# EAGLE design Main board (EAGLE 9.2.2)
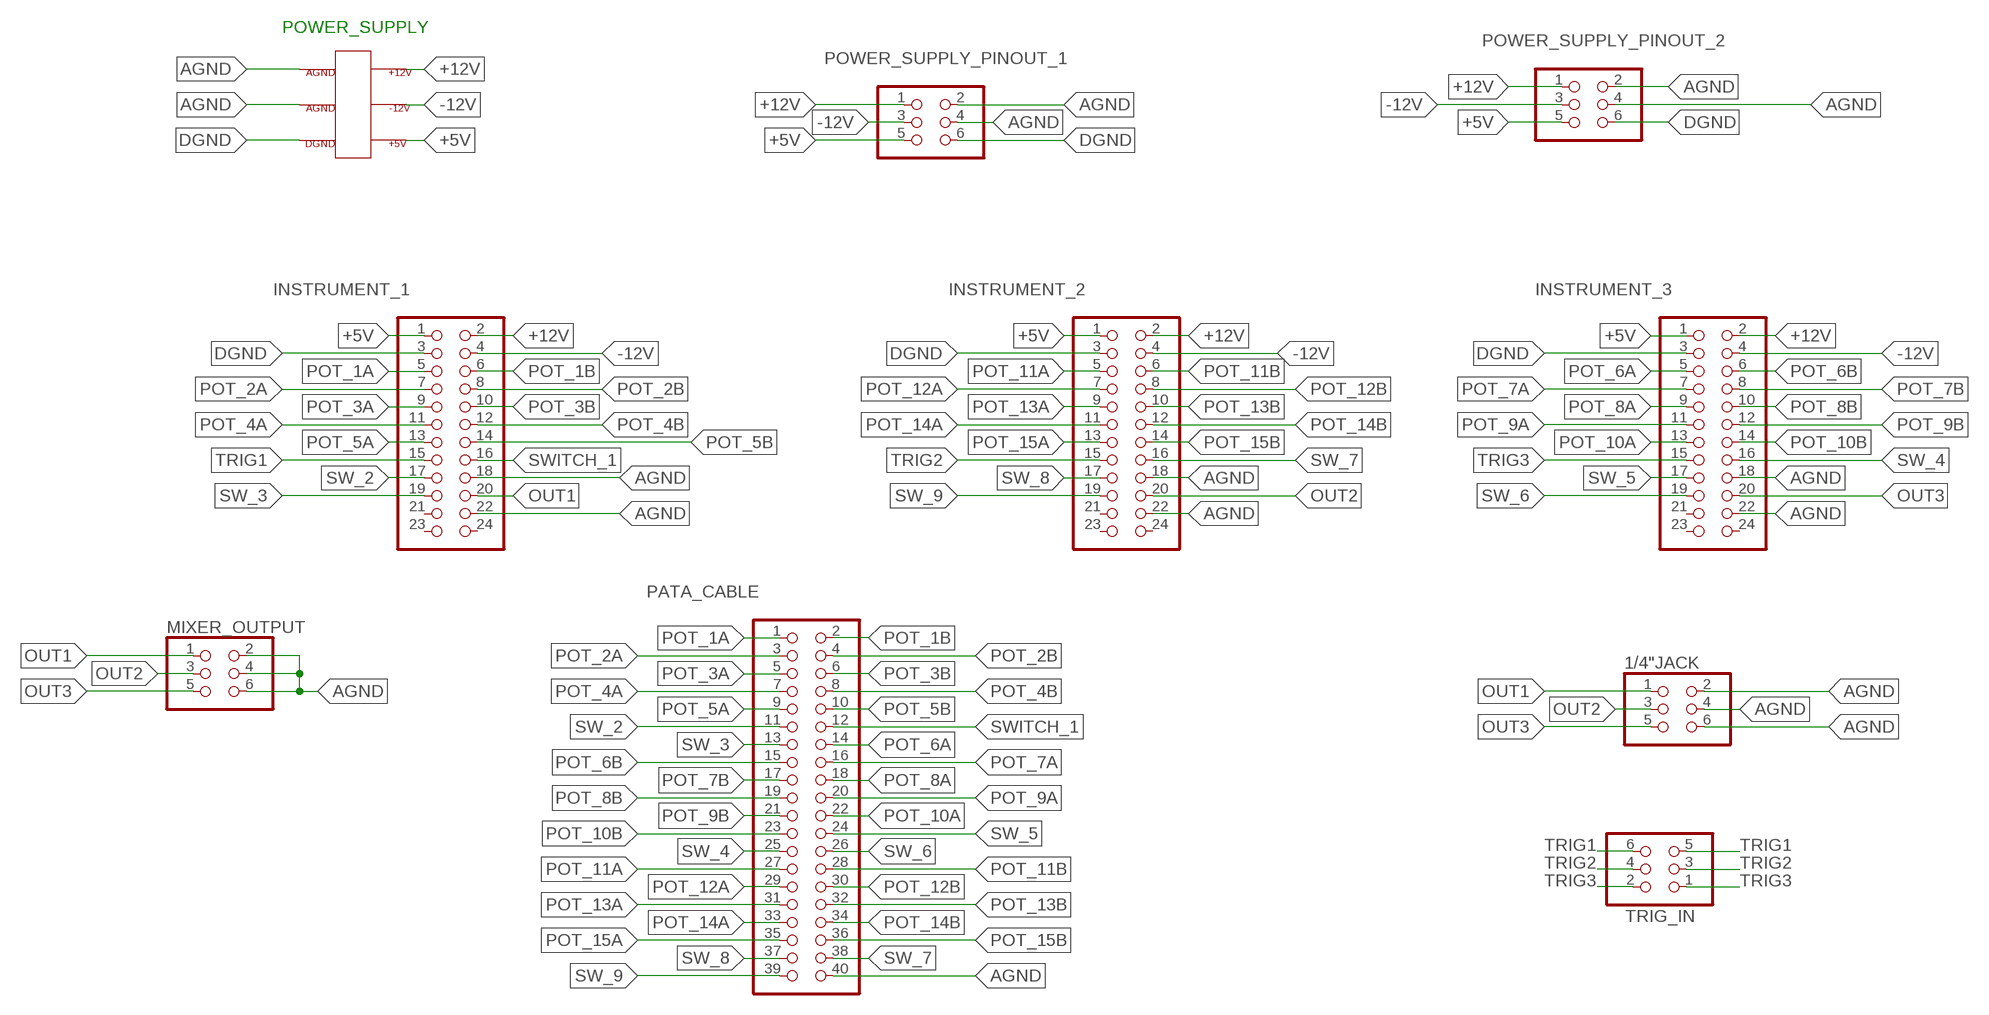
[diagram p0: schematic, sheet 1]

## Parts
1/4"JACK  PINHD-2X3  [2X03]
INSTRUMENT_1  PINHD-2X12  [2X12]
INSTRUMENT_2  PINHD-2X12  [2X12]
INSTRUMENT_3  PINHD-2X12  [2X12]
MIXER_OUTPUT  PINHD-2X3  [2X03]
PATA_CABLE  PINHD-2X20  [2X20]
POWER_SUPPLY  TER6PIN_VERT  [CAPSTONE_1-770875-0]
POWER_SUPPLY_PINOUT_1  PINHD-2X3  [2X03]
POWER_SUPPLY_PINOUT_2  PINHD-2X3  [2X03]
TRIG_IN  PINHD-2X3  [2X03]

## Nets
+5V: INSTRUMENT_1.1 INSTRUMENT_2.1 INSTRUMENT_3.1 POWER_SUPPLY.+5V POWER_SUPPLY.NULL(+5V) POWER_SUPPLY_PINOUT_1.5 POWER_SUPPLY_PINOUT_2.5
+12V: INSTRUMENT_1.2 INSTRUMENT_2.2 INSTRUMENT_3.2 POWER_SUPPLY.+12V POWER_SUPPLY_PINOUT_1.1 POWER_SUPPLY_PINOUT_2.1
-12V: INSTRUMENT_1.4 INSTRUMENT_2.4 INSTRUMENT_3.4 POWER_SUPPLY.-12V POWER_SUPPLY_PINOUT_1.3 POWER_SUPPLY_PINOUT_2.3
AGND: 1/4"JACK.2 1/4"JACK.4 1/4"JACK.6 INSTRUMENT_1.18 INSTRUMENT_1.22 INSTRUMENT_2.18 INSTRUMENT_2.22 INSTRUMENT_3.18 INSTRUMENT_3.22 MIXER_OUTPUT.2 MIXER_OUTPUT.4 MIXER_OUTPUT.6 PATA_CABLE.40 POWER_SUPPLY.AGND0 POWER_SUPPLY.AGND1 POWER_SUPPLY_PINOUT_1.2 POWER_SUPPLY_PINOUT_1.4 POWER_SUPPLY_PINOUT_2.2 POWER_SUPPLY_PINOUT_2.4
DGND: INSTRUMENT_1.3 INSTRUMENT_2.3 INSTRUMENT_3.3 POWER_SUPPLY.DGND POWER_SUPPLY_PINOUT_1.6 POWER_SUPPLY_PINOUT_2.6
OUT1: 1/4"JACK.1 INSTRUMENT_1.20 MIXER_OUTPUT.1
OUT2: 1/4"JACK.3 INSTRUMENT_2.20 MIXER_OUTPUT.3
OUT3: 1/4"JACK.5 INSTRUMENT_3.20 MIXER_OUTPUT.5
POT_1A: INSTRUMENT_1.5 PATA_CABLE.1
POT_1B: INSTRUMENT_1.6 PATA_CABLE.2
POT_2A: INSTRUMENT_1.7 PATA_CABLE.3
POT_2B: INSTRUMENT_1.8 PATA_CABLE.4
POT_3A: INSTRUMENT_1.9 PATA_CABLE.5
POT_3B: INSTRUMENT_1.10 PATA_CABLE.6
POT_4A: INSTRUMENT_1.11 PATA_CABLE.7
POT_4B: INSTRUMENT_1.12 PATA_CABLE.8
POT_5A: INSTRUMENT_1.13 PATA_CABLE.9
POT_5B: INSTRUMENT_1.14 PATA_CABLE.10
POT_6A: INSTRUMENT_3.5 PATA_CABLE.14
POT_6B: INSTRUMENT_3.6 PATA_CABLE.15
POT_7A: INSTRUMENT_3.7 PATA_CABLE.16
POT_7B: INSTRUMENT_3.8 PATA_CABLE.17
POT_8A: INSTRUMENT_3.9 PATA_CABLE.18
POT_8B: INSTRUMENT_3.10 PATA_CABLE.19
POT_9A: INSTRUMENT_3.11 PATA_CABLE.20
POT_9B: INSTRUMENT_3.12 PATA_CABLE.21
POT_10A: INSTRUMENT_3.13 PATA_CABLE.22
POT_10B: INSTRUMENT_3.14 PATA_CABLE.23
POT_11A: INSTRUMENT_2.5 PATA_CABLE.27
POT_11B: INSTRUMENT_2.6 PATA_CABLE.28
POT_12A: INSTRUMENT_2.7 PATA_CABLE.29
POT_12B: INSTRUMENT_2.8 PATA_CABLE.30
POT_13A: INSTRUMENT_2.9 PATA_CABLE.31
POT_13B: INSTRUMENT_2.10 PATA_CABLE.32
POT_14A: INSTRUMENT_2.11 PATA_CABLE.33
POT_14B: INSTRUMENT_2.12 PATA_CABLE.34
POT_15A: INSTRUMENT_2.13 PATA_CABLE.35
POT_15B: INSTRUMENT_2.14 PATA_CABLE.36
SW_2: INSTRUMENT_1.17 PATA_CABLE.11
SW_3: INSTRUMENT_1.19 PATA_CABLE.13
SW_4: INSTRUMENT_3.16 PATA_CABLE.25
SW_5: INSTRUMENT_3.17 PATA_CABLE.24
SW_6: INSTRUMENT_3.19 PATA_CABLE.26
SW_7: INSTRUMENT_2.16 PATA_CABLE.38
SW_8: INSTRUMENT_2.17 PATA_CABLE.37
SW_9: INSTRUMENT_2.19 PATA_CABLE.39
SWITCH_1: INSTRUMENT_1.16 PATA_CABLE.12
TRIG1: INSTRUMENT_1.15 TRIG_IN.5 TRIG_IN.6
TRIG2: INSTRUMENT_2.15 TRIG_IN.3 TRIG_IN.4
TRIG3: INSTRUMENT_3.15 TRIG_IN.1 TRIG_IN.2
Unconnected: INSTRUMENT_1.21 INSTRUMENT_1.23 INSTRUMENT_1.24 INSTRUMENT_2.21 INSTRUMENT_2.23 INSTRUMENT_2.24 INSTRUMENT_3.21 INSTRUMENT_3.23 INSTRUMENT_3.24

## Notes on the sheet
- POWER_SUPPLY

## Library data of the parts
1/4"JACK MIXER_OUTPUT POWER_SUPPLY_PINOUT_1 POWER_SUPPLY_PINOUT_2 TRIG_IN = pinhead:PINHD-2X3: PIN HEADER
INSTRUMENT_1-INSTRUMENT_3 = pinhead:PINHD-2X12: PIN HEADER
PATA_CABLE = pinhead:PINHD-2X20: PIN HEADER
POWER_SUPPLY = TE6Pin:TER6PIN_VERT

## Board
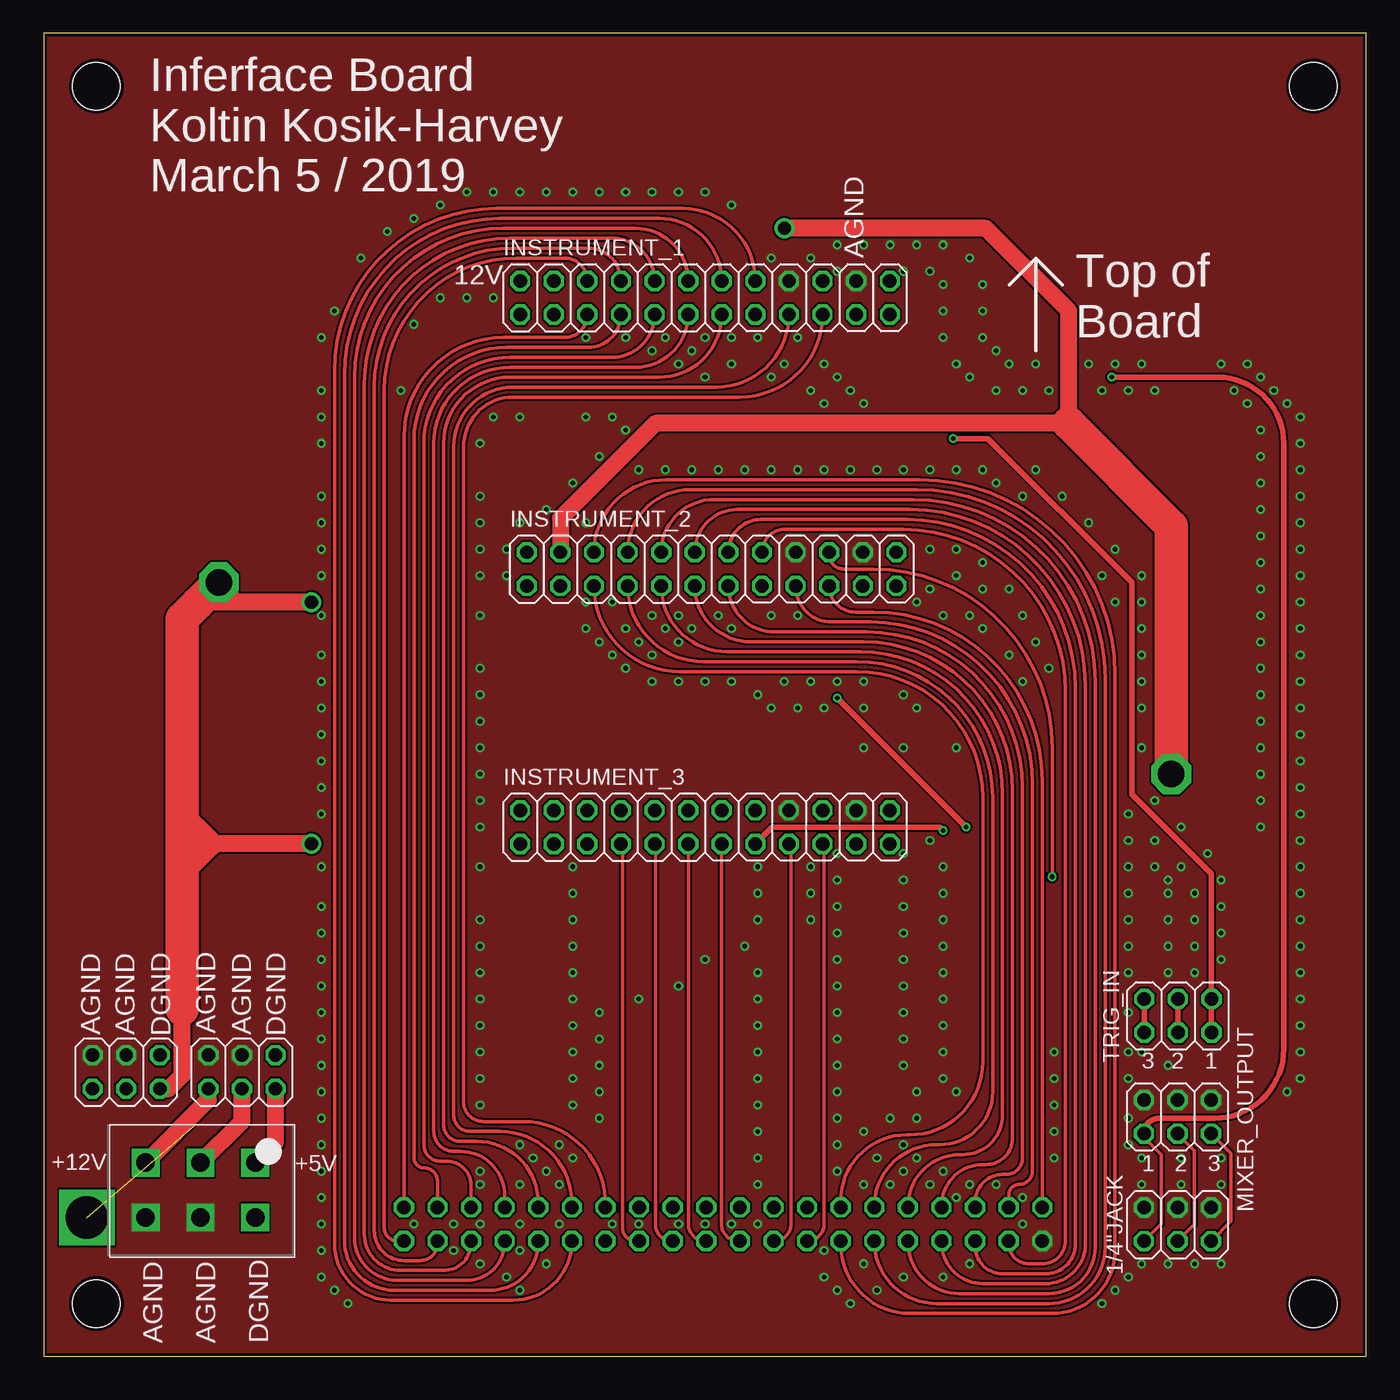
[diagram p1: board, top side]
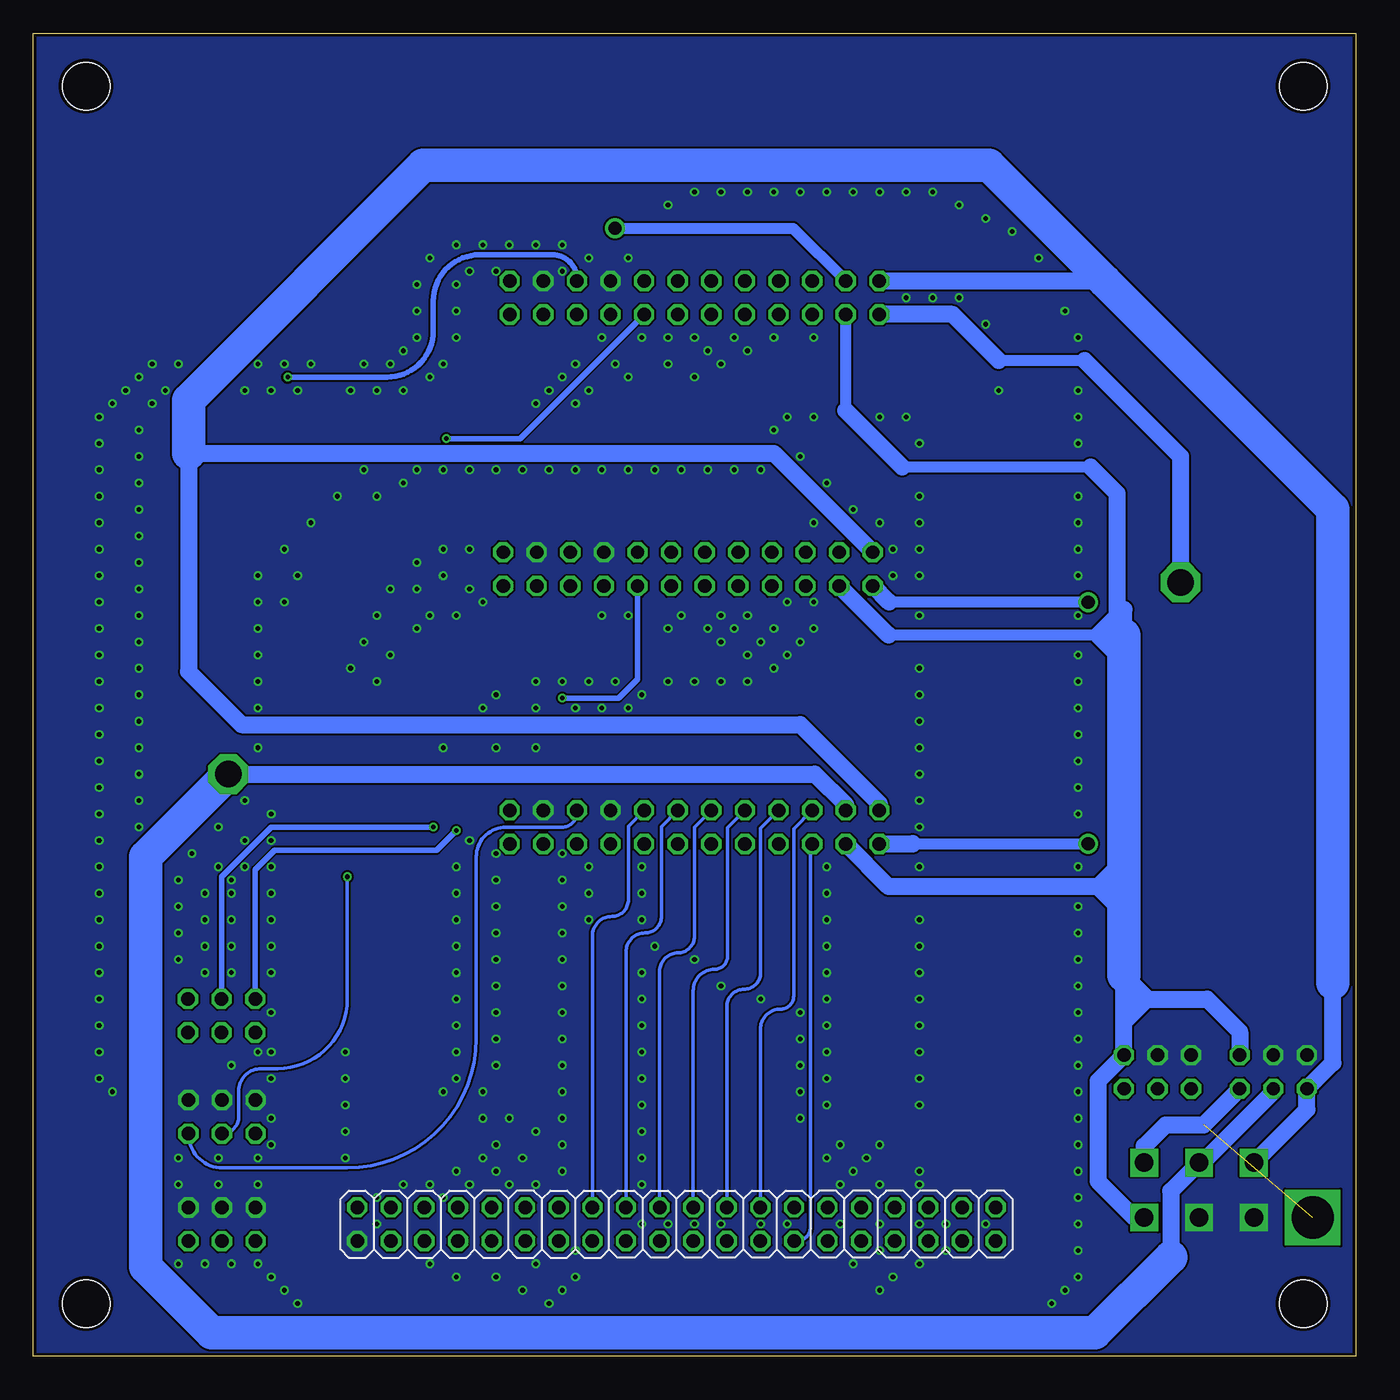
[diagram p2: board, bottom side, seen from below]

Size 100 x 100 mm. Coordinates in mm from the lower left corner, seen from the top.
Outline: 0,0 100,0 100,100 0,100 0,0
Copper layers (1*16): Top 0.035mm / dielectric 1.5mm / Bottom 0.035mm
Design rules "SeeedStudio_2layer_DRU_no_angle_20140221": minimum track width 6mil, minimum drill 12mil, track to track 6mil, track to pad 6mil, pad to pad 6mil, via to via 6mil, smd to smd 0mil, copper to edge 10mil, drill to drill 10mil, minimum pad ring 10mil, minimum via ring 6mil, stop-mask expansion 2mil, vias tented up to drill 100mil, thermal gap 10mil
Holes 3.6 mm at 4,4 4,96 96,96 96,4

### Footprints (pad centres in the part's own frame; a part is rotated, then mirrored left to right if it is on the bottom)
2X03 = drill 1.016 octagon: 1 -2.54,-1.27; 2 -2.54,1.27; 3 0,-1.27; 4 0,1.27; 5 2.54,-1.27; 6 2.54,1.27
2X12 = drill 1.016 octagon: 1 -13.97,-1.27; 2 -13.97,1.27; 3 -11.43,-1.27; 4 -11.43,1.27; 5 -8.89,-1.27; 6 -8.89,1.27; 7 -6.35,-1.27; 8 -6.35,1.27; 9 -3.81,-1.27; 10 -3.81,1.27; 11 -1.27,-1.27; 12 -1.27,1.27; 13 1.27,-1.27; 14 1.27,1.27; 15 3.81,-1.27; 16 3.81,1.27; 17 6.35,-1.27; 18 6.35,1.27; 19 8.89,-1.27; 20 8.89,1.27; 21 11.43,-1.27; 22 11.43,1.27; 23 13.97,-1.27; 24 13.97,1.27
2X20 = drill 1.016 octagon: 1 -24.13,-1.27; 2 -24.13,1.27; 3 -21.59,-1.27; 4 -21.59,1.27; 5 -19.05,-1.27; 6 -19.05,1.27; 7 -16.51,-1.27; 8 -16.51,1.27; 9 -13.97,-1.27; 10 -13.97,1.27; 11 -11.43,-1.27; 12 -11.43,1.27; 13 -8.89,-1.27; 14 -8.89,1.27; 15 -6.35,-1.27; 16 -6.35,1.27; 17 -3.81,-1.27; 18 -3.81,1.27; 19 -1.27,-1.27; 20 -1.27,1.27; 21 1.27,-1.27; 22 1.27,1.27; 23 3.81,-1.27; 24 3.81,1.27; 25 6.35,-1.27; 26 6.35,1.27; 27 8.89,-1.27; 28 8.89,1.27; 29 11.43,-1.27; 30 11.43,1.27; 31 13.97,-1.27; 32 13.97,1.27; 33 16.51,-1.27; 34 16.51,1.27; 35 19.05,-1.27; 36 19.05,1.27; 37 21.59,-1.27; 38 21.59,1.27; 39 24.13,-1.27; 40 24.13,1.27
CAPSTONE_1-770875-0 = drill 1.4 square: +5V 0,-4.14; +12V 8.28,-4.14; -12V 4.14,-4.14; AGND0 4.14,0; AGND1 8.28,0; DGND 0,0 | drill 3.18 square: NULL 12.73,0

### Placement (x,y rotation side)
1/4"JACK  85.72,9.98 0 top
INSTRUMENT_1  50,80 0 top
INSTRUMENT_2  50.5,59.5 0 top
INSTRUMENT_3  50,40 0 top
MIXER_OUTPUT  85.72,18.11 0 top
PATA_CABLE  51.37,10 180 bottom
POWER_SUPPLY  16,10.5 180 top
POWER_SUPPLY_PINOUT_1  6.25,21.5 0 top
POWER_SUPPLY_PINOUT_2  15,21.5 0 top
TRIG_IN  85.75,25.75 0 top

### Tracks (layer width: path | path; a pad name or v marks a point on that pad's centre or on a via)
+5V  (via drill 1, 2)  (1 unrouted)
  Top 1.016: 14.5,57 14.5,57.25 v13.25,58.5
  Top 1.27: POWER_SUPPLY.+5V 17.54,16.18 POWER_SUPPLY_PINOUT_2.5 | POWER_SUPPLY_PINOUT_1.5 9.48,20.23 10.5,21.25 10.5,26.25 | 11.62,56.88 11.75,57 14.5,57 v20.25,57 | v20.25,38.75 12.75,38.75 | 12.75,38.75 10.5,38.75 | 12.75,38.75 12.75,39 10.5,41.25 | 12.75,38.75 12.75,38.5 10.5,36.25
  Top 2.54: 10.5,26.25 10.5,36.25 10.5,38.75 10.5,41.25 10.5,55.75 11.62,56.88 v13.25,58.5
  Bottom 0.813: 20.5,75.25 27,75.25 | v20.25,57 35.3,57 | 33.5,38.75 v20.25,38.75
  Bottom 1.27: POWER_SUPPLY.+5V 16,15.89 14.39,17.5 11.52,17.5 POWER_SUPPLY_PINOUT_1.5 | 27,75.25 30.5,78.75 36.01,78.75 INSTRUMENT_1.1 | v13.25,58.5 13.25,68 20.5,75.25 | 35.3,57 INSTRUMENT_2.1 | INSTRUMENT_3.1 33.52,38.73 33.5,38.75
+12V
  Top 1.27: POWER_SUPPLY.+12V 12.46,19.38 POWER_SUPPLY_PINOUT_2.1
  Bottom 1.27: POWER_SUPPLY.+12V 3.71,18.65 POWER_SUPPLY_PINOUT_1.1 1.75,22.19 1.75,28.25 | 19,81.25 36.01,81.25 INSTRUMENT_1.2 | INSTRUMENT_2.2 44.01,68.25 88.25,68.25 88.25,51.75 84.25,47.75 42.01,47.75 36.03,41.77 INSTRUMENT_3.2
  Bottom 2.54: 1.75,28.25 1.75,64 19,81.25 27.75,90 70.5,90 88.25,72.25 88.25,68.25
-12V  (via drill 1, 2)
  Top 1.27: POWER_SUPPLY.-12V 15,17.78 POWER_SUPPLY_PINOUT_2.3 | INSTRUMENT_2.4 39.07,63.32 46.25,70.5 77.5,70.5 77.5,79 71.25,85.25 v56,85.25
  Top 2.54: v85.25,44 85.25,62.75 77.5,70.5
  Bottom 0.813: v56,85.25 42.55,85.25 INSTRUMENT_1.4
  Bottom 1.27: POWER_SUPPLY_PINOUT_1.3 6.25,20 11.61,14.64 POWER_SUPPLY.-12V 14,12.5 14,7.5 | INSTRUMENT_3.4 38.57,41.67 40.9,44 v85.25,44
  Bottom 2.54: 14,7.5 19.73,1.77 86.5,1.77 91.5,6.77 91.5,37.75 v85.25,44
AGND  (via drill 0.35)
  other vias: 21,6 21,8 21,10 21,12 21,14 21,16 21,18 21,20 21,22 21,24 21,26 21,28 21,30 21,32 21,34 21,37 21,41 21,43 21,45 21,47 21,49 21,51 21,53 21,56 21,59 21,61 21,63 21,65 21,69 21,71 21,73 21,77 22,79 24,83 26,85 28,86 30,87 32,88 34,88 36,88 38,88 40,88 42,88 44,88 46,88 48,88 50,88 52,87 55,83 58,83 60,84 62,84 64,84 66,84 68,84 70,83 71,81 71,79 71,77 72,76 73,75 75,75 79,75 81,75 83,75 89,75 91,75 92,74 93,73 94,72 95,71 95,69 95,67 95,65 95,63 95,61 95,59 95,57 95,55 95,53 95,51 95,49 95,47 95,45 95,43 95,41 95,39 95,37 95,35 95,33 95,31 95,29 95,27 95,25 95,23 95,21 94,20 89,15 89,13 86,13 86,15 83,15 83,13 83,7 85,7 87,7 89,7 81,5 82,6 80,4 61,4 60,5 59,6 59,8 62,7 63,5 65,6 68,6 70,7 74,10 76.4,15 76.4,17 76.4,19 76.4,21 76.4,23 85,22 83,23 92,40 92,42 92,44 92,46 92,48 92,50 92,52 92,54 92,56 92,58 92,60 92,62 92,64 92,66 92,68 92,70 91,72 90,73 84,73 82,73 80,73 76,73 74,73 72,73 70,74 69,75 68,77 68,79 68,81 67,82 65,82 60,82 50,74 52,75 54,77 52,77 49,76 48,75 50,77 47,77 46,76 44,77 41,77 27,73 30,80 32,80 34,80 28,78 33,19 33,21 33,23 33,25 33,27 33,29 33,31 33,33 33,37 33,40 33,42 33,44 33,46 33,48 33,50 33,52 33,56 33,59 33,61 33,63 33,65 33,69 34,71 36,71 41,71 43,71 35,59 35,61 36,63 38,64 40,66 42,68 44,70 41,63 45,67 47,67 49,67 51,67 53,67 55,67 57,67 59,67 61,67 63,67 65,67 67,67 69,67 72,66 71,67 74,65 80,59 81,57 76,52 75,54 74,56 73,58 71,60 69,61 67,61 69,59 71,58 74,51 73,53 71,55 70,56 68,56 67,58 66,57 69,46 65,46 66,49 65,50 62,51 60,51 58,51 56,51 54,50 57,49 55,49 59,49 62,49 62,46 55,56 57,56 52,55 51,56 49,55 48,56 46,56 47,55 48,54 43,57 44,55 45,54 46,53 41,57 41,55 42,54 43,53 44,52 46,51 48,51 50,51 52,51 40,31 40,33 40,35 40,37 40,29 40,27 40,25 40,23 40,21 40,19 42,18 42,20 42,22 42,24 42,26 45,27 48,28 50,30 53,31 54,29 54,27 54,25 54,23 54,21 54,19 54,17 54,15 54,13 54,33 54,35 54,37 58,37 58,35 60,14 60,16 60,18 60,20 60,22 60,24 60,26 60,28 60,30 60,32 60,34 60,36 60,38 58,33 62,17 64,18 66,18 69,20 68,21 68,23 68,25 68,27 68,29 68,31 68,33 68,35 68,37 67,39 65,38 65,36 65,34 65,32 65,30 65,28 65,26 65,24 65,22 66,20 62,13 63,15 65,16 64,13 65,14 66,15 67,13 68,14 69,12 70,13 72,13 74,12 82,37 82,35 82,33 82,31 82,29 82,26 82,23 82,21 82,16 82,18 75,67 77,65 79,63 81,61 83,59 83,57 83,55 83,53 83,51 83,49 83,46 82,41 84,39 86,37 87,35 84,42 86,40 88,38 89,36 89,34 89,32 89,30 87,29 87,31 87,33 85,29 85,31 85,33 85,35 85,36 84,37 82,39 62,72 60,74 59,75 57,77 56,75 55,74 58,73 59,72 61,73 39,16 40,15 39,13 38,14 37,15 36,16 36,13 33,13 33,14 33,10 31,10 28,10 36,10 39,10 43,10 45,10 48,10 50,10 52,10 54,10 38,7 36,5 35,6 36,8 33,7 31,8 22,5 23,4
  pour Top (no thermals): -1,0 -1,100 100,100 100,0
  pour Bottom (no thermals): -1.5,0 -1.5,100 100,100 100,0
DGND
  Bottom 0.813: 38.57,71.48 INSTRUMENT_1.3 | 34.32,67.23 20.07,67.23 | 19.5,54.5 35.34,54.5
  Bottom 1.27: 17.54,25.25 POWER_SUPPLY_PINOUT_2.6 19.5,20.81 19.5,13.25 16.75,10.5 POWER_SUPPLY.DGND | 17.54,25.25 17.54,27 | 17.54,27 17.54,28.79 15.75,27 | 17.54,56.46 17.54,54.5 19.5,54.5 | 38.57,71.48 34.32,67.23 | 20.07,67.23 18.04,65.2 18.04,55.96 19.5,54.5 | 35.34,54.5 INSTRUMENT_2.3 | 19.5,54.5 17.54,52.54 | 17.54,27 15.79,27 | 15.75,27 11.25,27 8.79,24.54 POWER_SUPPLY_PINOUT_1.6 | 17.54,25.25 15.79,27 | 15.79,27 15.75,27 | 17.54,35.5 19.5,35.5 | 19.5,35.5 35.34,35.5 INSTRUMENT_3.3 | 19.5,35.5 17.54,37.46 | 19.5,35.5 17.54,33.54
  Bottom 2.54: 17.54,54.5 17.54,52.54 17.54,37.46 17.54,35.5 17.54,33.54 17.54,28.79
OUT1  (via drill 0.35)
  Top 0.254: MIXER_OUTPUT.1 83.18,16.57 84.5,15.25 84.5,10.03 1/4"JACK.1
  Top 0.406: v80.75,74 88.75,74 arc-90 93.75,69 93.75,23.25 arc-90 88.5,18 84.34,18 arc90 MIXER_OUTPUT.1
  Bottom 0.406: INSTRUMENT_1.20 58.89,81.39 arc-90 60.75,83.25 66.25,83.25 arc-90 69.75,79.75 69.75,77.5 arc90 73.25,74 v80.75,74
OUT2  (via drill 0.35)
  Top 0.254: v76.25,36.25 76.25,46 arc90 62.75,59.5 60.5,59.5 arc-90 59.39,60.61 INSTRUMENT_2.20 | MIXER_OUTPUT.3 87,15.56 87,9.99 1/4"JACK.3
  Bottom 0.254: v76.25,36.25 76.25,27 arc90 81.5,21.75 82.75,21.75 arc-90 84.45,20.05 84.45,18.11 arc90 MIXER_OUTPUT.3
OUT3
  Top 0.254: MIXER_OUTPUT.5 89.75,15.35 89.75,10.2 1/4"JACK.5
  Bottom 0.254: MIXER_OUTPUT.5 arc-90 85.67,14.25 76.25,14.25 arc-90 66.5,24 66.5,37.75 arc90 64.25,40 60,40 arc-90 58.89,41.11 INSTRUMENT_3.20
POT_1A
  Top 0.254: PATA_CABLE.1 arc90 PATA_CABLE.1 27.25,69.5 arc-90 34.75,77 39.38,77 arc90 INSTRUMENT_1.5
POT_1B
  Top 0.254: PATA_CABLE.2 26.77,8.73 arc-90 25.75,9.75 25.75,73 arc-90 35.75,83 39.38,83 arc-90 INSTRUMENT_1.6
POT_2A
  Top 0.254: PATA_CABLE.3 29.78,13.22 arc90 28.75,14.25 arc-90 28,15 28,69.25 arc-90 35,76.25 41.17,76.25 arc90 INSTRUMENT_1.7
POT_2B
  Top 0.254: PATA_CABLE.4 29.78,8.53 arc-90 28.5,7.25 27.25,7.25 arc-90 25,9.5 25,73.25 arc-90 35.5,83.75 41.17,83.75 arc-90 INSTRUMENT_1.8
POT_3A
  Top 0.254: PATA_CABLE.5 32.32,12.93 arc90 30.5,14.75 30,14.75 arc-90 28.75,16 28.75,69 arc-90 35.25,75.5 42.96,75.5 arc90 INSTRUMENT_1.9
POT_3B
  Top 0.254: PATA_CABLE.6 32.32,8.57 arc-90 30.25,6.5 27,6.5 arc-90 24.25,9.25 24.25,73.5 arc-90 35.25,84.5 42.96,84.5 arc-90 INSTRUMENT_1.10
POT_4A
  Top 0.254: PATA_CABLE.7 34.86,12.14 arc90 31.5,15.5 31,15.5 arc-90 29.5,17 29.5,69 arc-90 35.25,74.75 44.75,74.75 arc90 INSTRUMENT_1.11
POT_4B
  Top 0.254: PATA_CABLE.8 34.86,8.61 arc-90 32,5.75 26.75,5.75 arc-90 23.5,9 23.5,74 arc-90 34.75,85.25 44.75,85.25 arc-90 INSTRUMENT_1.12
POT_5A
  Top 0.254: PATA_CABLE.9 37.4,11.6 arc90 32.75,16.25 31.5,16.25 arc-90 30.25,17.5 30.25,69 arc-90 35.25,74 46.54,74 arc90 INSTRUMENT_1.13
POT_5B
  Top 0.254: PATA_CABLE.10 37.4,8.65 arc-90 33.75,5 26.5,5 arc-90 22.75,8.75 22.75,74.25 arc-90 34.5,86 46.54,86 arc-90 INSTRUMENT_1.14
POT_6A
  Bottom 0.254: PATA_CABLE.14 42.27,8.73 arc-90 41.25,9.75 41.25,38.59 arc90 INSTRUMENT_3.5
POT_6B
  Bottom 0.254: PATA_CABLE.15 45.02,24.73 arc90 43.5,26.25 arc-90 42.5,27.25 42.5,39.88 INSTRUMENT_3.6
POT_7A
  Top 0.254: PATA_CABLE.16 44.77,8.73 arc-90 43.75,9.75 43.75,38.63 arc90 INSTRUMENT_3.7
POT_7B
  Bottom 0.254: INSTRUMENT_3.8 45,39.92 45,29 arc90 46.25,27.75 arc-90 47.56,26.44 PATA_CABLE.17
POT_8A
  Top 0.254: PATA_CABLE.18 47.52,8.73 arc-90 46.25,10 46.25,38.67 arc90 INSTRUMENT_3.9
POT_8B
  Bottom 0.254: PATA_CABLE.19 50.1,27.65 arc90 48.5,29.25 arc-90 47.5,30.25 47.5,39.96 INSTRUMENT_3.10
POT_9A
  Top 0.254: PATA_CABLE.20 50.02,8.73 arc-90 48.75,10 48.75,38.71 arc90 INSTRUMENT_3.11
POT_9B
  Bottom 0.254: INSTRUMENT_3.12 50,40 50,31.75 arc90 51.25,30.5 arc-90 52.64,29.11 PATA_CABLE.21
POT_10A
  Top 0.254: INSTRUMENT_3.13 arc90 51.25,38.71 51.25,10 arc90 52.52,8.73 PATA_CABLE.22
POT_10B
  Bottom 0.254: PATA_CABLE.23 55.18,30.57 arc90 53.75,32 arc-90 52.5,33.25 52.5,40.04 INSTRUMENT_3.14
POT_11A
  Top 0.254: PATA_CABLE.27 60.26,11.76 arc-90 65.25,16.75 65.5,16.75 arc90 71,22.25 71,42.25 arc90 61.5,51.75 48.09,51.75 arc-90 INSTRUMENT_2.5
POT_11B
  Top 0.254: PATA_CABLE.28 60.26,8.49 arc90 65.5,3.25 76.25,3.25 arc90 81,8 81,51.5 arc90 66.25,66.25 47.09,66.25 arc90 INSTRUMENT_2.6
POT_12A
  Top 0.254: PATA_CABLE.29 62.8,11.3 arc-90 67.5,16 67.75,16 arc90 71.75,20 71.75,42.25 arc90 61.5,52.5 49.88,52.5 arc-90 INSTRUMENT_2.7
POT_12B
  Top 0.254: PATA_CABLE.30 62.8,8.7 arc90 67.5,4 76,4 arc90 80.25,8.25 80.25,51.25 arc90 66,65.5 48.88,65.5 arc90 INSTRUMENT_2.8
POT_13A
  Top 0.254: PATA_CABLE.31 65.34,11.34 arc-90 69.25,15.25 69.5,15.25 arc90 72.5,18.25 72.5,42.5 arc90 61.75,53.25 51.67,53.25 arc-90 INSTRUMENT_2.9
POT_13B
  Top 0.254: PATA_CABLE.32 65.34,8.66 arc90 69.25,4.75 76,4.75 arc90 79.5,8.25 79.5,51 arc90 65.75,64.75 50.67,64.75 arc90 INSTRUMENT_2.10
POT_14A
  Top 0.254: PATA_CABLE.33 67.88,11.38 arc-90 71,14.5 71.25,14.5 arc90 73.25,16.5 73.25,42.75 arc90 62,54 53.46,54 arc-90 INSTRUMENT_2.11
POT_14B
  Top 0.254: PATA_CABLE.34 67.88,8.62 arc90 71,5.5 75.75,5.5 arc90 78.75,8.5 78.75,50.75 arc90 65.5,64 52.46,64 arc90 INSTRUMENT_2.12
POT_15A
  Top 0.254: PATA_CABLE.35 70.42,11.67 arc-90 72.5,13.75 72.75,13.75 arc90 74,15 74,43 arc90 62.25,54.75 55.25,54.75 arc-90 INSTRUMENT_2.13
POT_15B
  Top 0.254: PATA_CABLE.36 70.42,8.33 arc90 72.5,6.25 75.75,6.25 arc90 78,8.5 78,50.5 arc90 65.25,63.25 54.25,63.25 arc90 INSTRUMENT_2.14
SW_2
  Top 0.254: PATA_CABLE.11 39.94,11.56 arc90 34.5,17 32.25,17 arc-90 31,18.25 31,68.75 arc-90 35.5,73.25 50.87,73.25 arc90 INSTRUMENT_1.17
SW_3
  Top 0.254: PATA_CABLE.13 42.48,11.52 arc90 36.25,17.75 33.25,17.75 arc-90 31.75,19.25 31.75,68.75 arc-90 35.5,72.5 52.66,72.5 arc90 INSTRUMENT_1.19
SW_4
  Bottom 0.254: INSTRUMENT_3.16 55,40.08 55,34.5 arc90 56.25,33.25 arc-90 57.72,31.78 PATA_CABLE.25
SW_5
  Top 0.254: PATA_CABLE.24 55.23,8.73 arc90 56.5,10 56.5,38.58 arc90 INSTRUMENT_3.17
SW_6
  Top 0.254: INSTRUMENT_3.19 arc-90 59,38.62 59,10 arc-90 PATA_CABLE.26
SW_7
  Top 0.254: PATA_CABLE.38 72.96,8.54 arc90 74.5,7 75.5,7 arc90 77.25,8.75 77.25,50.25 arc90 65,62.5 56.04,62.5 arc90 INSTRUMENT_2.16
SW_8
  Top 0.254: PATA_CABLE.37 72.96,12.21 arc-90 73.75,13 arc90 74.75,14 74.75,43.25 arc90 62.5,55.5 59.58,55.5 arc-90 INSTRUMENT_2.17
SW_9
  Top 0.254: PATA_CABLE.39 75.5,43.5 arc90 62.75,56.25 61.37,56.25 arc-90 INSTRUMENT_2.19
SWITCH_1
  Top 0.254: PATA_CABLE.12 39.94,8.69 arc-90 35.5,4.25 26.25,4.25 arc-90 22,8.5 22,74.5 arc-90 34.25,86.75 48.33,86.75 arc-90 INSTRUMENT_1.16
TRIG1  (via drill 0.35)
  Top 0.406: TRIG_IN.5 TRIG_IN.6 88.29,36.46 82.25,42.5 82.25,58.5 71.39,69.36 v68.75,69.36
  Bottom 0.406: v68.75,69.36 63.17,69.36 INSTRUMENT_1.15
TRIG2  (via drill 0.35)
  Top 0.406: TRIG_IN.4 TRIG_IN.3 | v69.75,40 v60,49.75
  Bottom 0.406: v69.75,40 82,40 85.75,36.25 TRIG_IN.4 | v60,49.75 55.75,49.75 54.31,51.19 INSTRUMENT_2.15
TRIG3  (via drill 0.35)
  Top 0.406: TRIG_IN.2 TRIG_IN.1 | v68,39.75 67.75,40 55.08,40 INSTRUMENT_3.15
  Bottom 0.406: TRIG_IN.2 83.21,36.79 81.75,38.25 69.5,38.25 v68,39.75

### Text on the board
tPlace: Inferface Board / Koltin Kosik-Harvey / March 5 / 2019 | AGND | 12V | Top of / Board | AGND | AGND | DGND | AGND | AGND | DGND | 3 | 2 | 1 | +12V | +5V | 1 | 2 | 3 | AGND | AGND | DGND